# Altium schematic sheet motherboard.SchDoc
size B; SheetNumber: 1; SheetTotal: 1
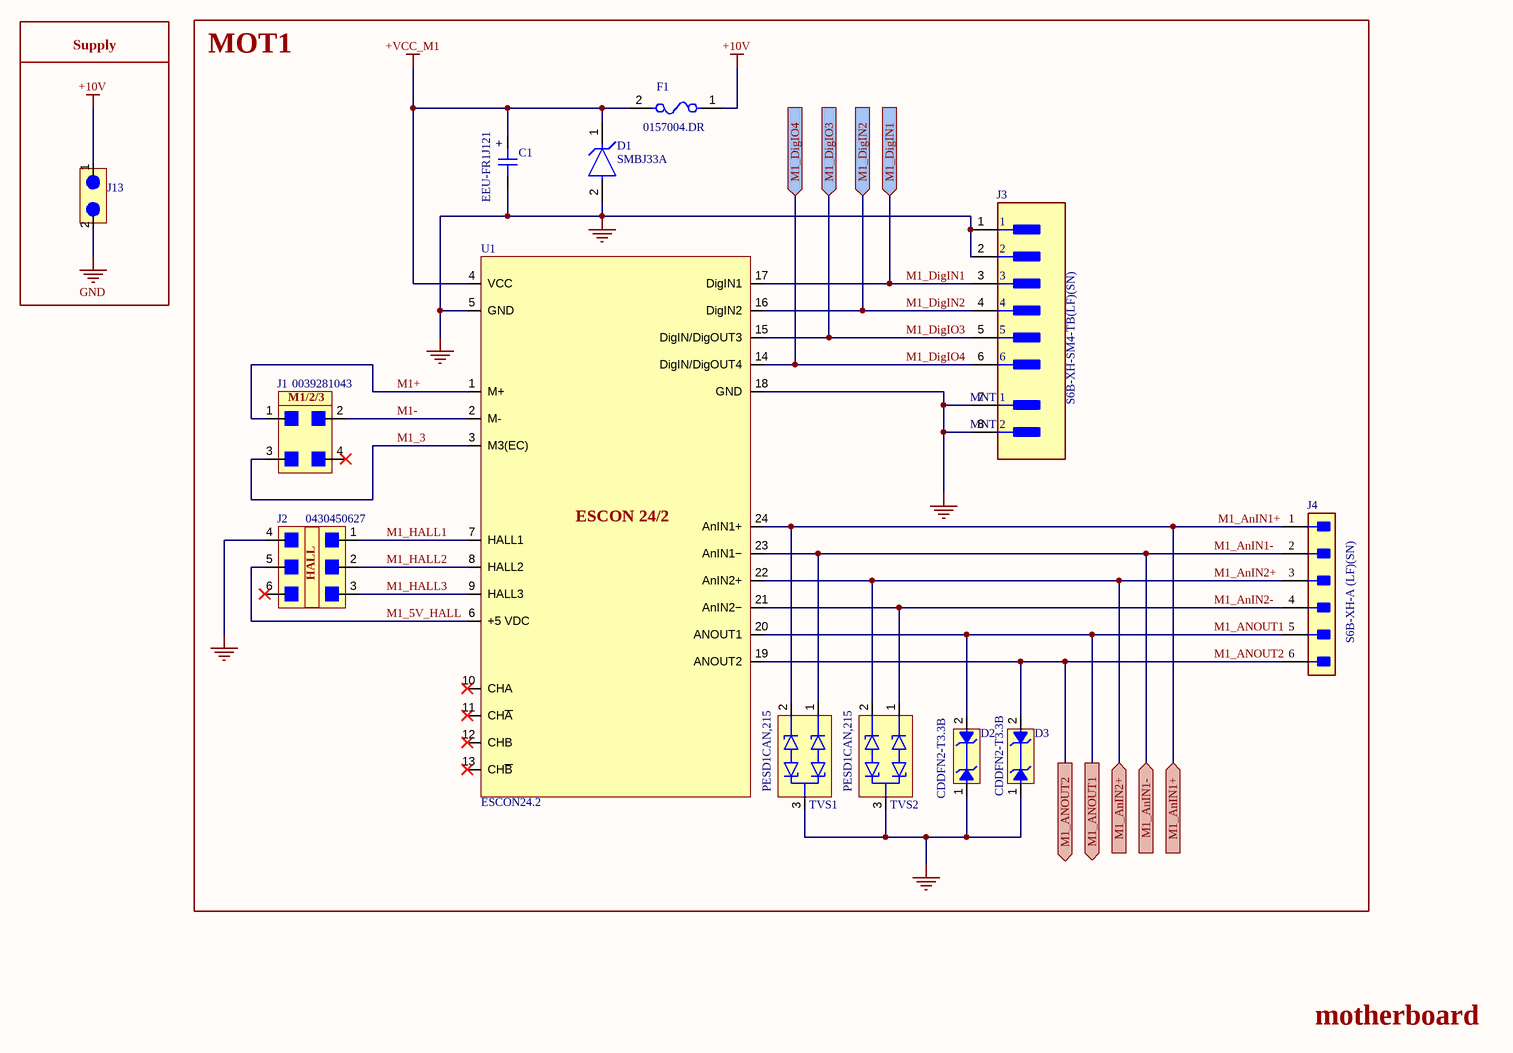
[diagram p0: motherboard.SchDoc]

## Parts
C1  EEU-FR1J121  [CAP_THT_RAD_5mm]
D1  SMBJ33A  [DO-214AA, SMB]
D2  CDDFN2-T3.3B  [D_0402]
D3  CDDFN2-T3.3B  [D_0402]
F1  0157004.DR  [NANO2]
J1  0039281043  [4.20mm Dual Row 4 Circuit CONN]
J2  0430450627  [3.00MM DUAL ROW 6 Circuit CONN]
J3  S6B-XH-SM4-TB(LF)(SN)  [S6B-XH-SM4-TB]
J4  S6B-XH-A (LF)(SN)  [JST-XH-6PIN_RA]
J13  POWER_CONN  [POWER]  (value not drawn)
TVS1  PESD1CAN,215  [SOT23]
TVS2  PESD1CAN,215  [SOT23]
U1  ESCON24.2  [ESCON24.2]

## Blocks framed on the sheet
Supply: J13
MOT1: C1 D1-D3 F1 J1-J4 TVS1 TVS2 U1

## Ports
M1_AnIN1+ (in), M1_AnIN1- (in), M1_AnIN2+ (in), M1_ANOUT1 (out), M1_ANOUT2 (out), M1_DigIN1 (in), M1_DigIN2 (in), M1_DigIO3 (in), M1_DigIO4 (in)

## Nets
+10V: F1.1 J13.1(+10V)
+VCC_M1: C1.1 D1.1(C) F1.2 U1.4(VCC)
GND: C1.2 D1.2(A) D2.1 D3.1 J2.4 J3.1 J3.2 J3.7(MNT_1) J3.8(MNT_2) J13.2(GND) TVS1.3(CC) TVS2.3(CC) U1.5(GND) U1.18(GND)
M1+: J1.1 U1.1(M+)
M1-: J1.2 U1.2(M-)
M1_3: J1.3 U1.3(M3(EC))
M1_5V_HALL: J2.5 U1.6(+5_VDC)
M1_AnIN1+: J4.1 TVS1.2(C2) U1.24(AnIN1+) ; port M1_AnIN1+
M1_AnIN1-: J4.2 TVS1.1(C1) U1.23(AnIN1−) ; port M1_AnIN1-
M1_AnIN2+: J4.3 TVS2.2(C2) U1.22(AnIN2+) ; port M1_AnIN2+
M1_AnIN2-: J4.4 TVS2.1(C1) U1.21(AnIN2−)
M1_ANOUT1: D2.2 J4.5 U1.20(ANOUT1) ; port M1_ANOUT1
M1_ANOUT2: D3.2 J4.6 U1.19(ANOUT2) ; port M1_ANOUT2
M1_DigIN1: J3.3 U1.17(DigIN1) ; port M1_DigIN1
M1_DigIN2: J3.4 U1.16(DigIN2) ; port M1_DigIN2
M1_DigIO3: J3.5 U1.15(DigIN/DigOUT3) ; port M1_DigIO3
M1_DigIO4: J3.6 U1.14(DigIN/DigOUT4) ; port M1_DigIO4
M1_HALL1: J2.1 U1.7(HALL1)
M1_HALL2: J2.2 U1.8(HALL2)
M1_HALL3: J2.3 U1.9(HALL3)

Not connected (* = marked no-connect by the designer): J1 4*; J2 6*; U1 10(CHA)* 11(CH~{A})* 12(CHB)* 13(CH~{B})*

## Notes on the sheet
- motherboard
- DWG. NO.
- REV.
- SHT.
- REVISION
- DESCRIPTION
- DATE
- APPROVED
- THIS DOCUMENT AND THE DATA DISCLOSED HEREIN OR HEREWITH IS THE PROPERTY OF ALTIUM LIMITED AND MAY BE FREELY DISTRIBUTED IN WHOLE. NO RIGHTS ARE RESERVED OR EXPRESS OR IMPLIED WARANTEE GIVEN.
- ENG:
- DSN:
- APPROVALS
- PROJECT
- DOCUMENT REVISION:
- DESIGN ITEM:
- CHK:
- BOM:
- REFERENCE DOCUMENTS
- PROJECT REVISION:
- TITLE
- FAB DWG:
- PCB DWG:
- ASSY DWG:
- SCALE:
- SIZE
- C
- CAGE CODE
- FILE NAME
- DWG NO.
- SHEET
- OF
- REV
- (in symbol 0039281043) M1/2/3
- (in symbol 0430450627) HALL
- (in symbol EEU-FR1J121) +
- (in symbol ESCON24.2) ESCON 24/2

## Library data of the parts
C1 = EEU-FR1J121: CAP, ELEC, 120 µF 63 V Aluminum Electrolytic Capacitors Radial, Can 8000 Hrs @ 105°C
D1 = SMBJ33A: TVS DIODE 33V 53.3V DO214AA; Manufacturer: Littelfuse Inc; Max Junction Temp: +150°C; Number Of Channels: 1; Breakdown Voltage: 36.7V; Peak Pulse Power: 600W; Direction: Unidirectional; Peak Pulse Current: 11.3A; Lead Free: Yes; Height: 2.61mm; Temperature Range Low: -65°C; ComponentLink2URL: https://www.littelfuse.com/~/media/electronics/datasheets/tvs_diodes/littelfuse_tvs_diode_smbj_datasheet.pdf.pdf; Manufacturer Part Number: SMBJ33A; Clamping Voltage: 53.3V; Device Class L1: Circuit Protection; Octopart: https://octopart.com/smbj33a-littelfuse-350829; Device Class L2: TVS Diodes; Digikey Description: TVS DIODE 33V 53.3V DO214AA; Automotive: No; Temperature Range High: +150°C; Package: SMBJ; ComponentLink2Description: Datasheet; Mouser Description: TVS DIODE 33V 53.3V DO214AA; Reverse Standoff Voltage: 33V; Category: Diode; Device Class L3: unset; Temperature: -65°C to +150°C; RoHS: TRUE
D2 D3 = CDDFN2-T3.3B: 8V Clamp 5A (8/20Âµs) Ipp Tvs Diode Surface Mount 2-DFN (1x0.6); MF: Bourns; Check_prices: https://www.snapeda.com/parts/CDDFN2-T3.3B/Bourns/view-part/510185/?ref=eda; Availability: Good; Price: None; SnapEDA_Link: https://www.snapeda.com/parts/CDDFN2-T3.3B/Bourns/view-part/510185/?ref=snap; Value: *; MP: CDDFN2-T3.3B; Package: XDFN-2 Bourns; Purchase-URL: https://pricing.snapeda.com/search/part/CDDFN2-T3.3B/?ref=eda
F1 = 0157004.DR: FUSE, 4 A 125 V 125 V Fuse Board Mount (Cartridge Style Excluded) Requires Holder, Surface Mount 2-SMD, Square End Block with Clip; Voltage Rating (DC): 125V; DC Cold Resistance: 16.3mR; Current Rating: 4A; Approvals: cULus; Lead Free: Lead Free; Package Quantity: 1500; Width: 0.146inch; Case/Package: SMD/SMT; Height: 0.154inch; Fuse Type: Board Mount (Cartridge Style Excluded); Max Operating Temperature: 125°C; REACH SVHC: No SVHC; Depth: 3.7mm; Housing Material: Ceramic; Fuse Current: 4A; Length: 6.5mm; Voltage Rating (AC): 125V; Packaging: Tape and Reel; Min Operating Temperature: -55°C; Mount: Surface Mount
J1 = 0039281043: Molex Connector Header Through Hole 4 position 0.165" (4.20mm)
J2 = 0430450627: Molex Connector Header Through Hole 6 position 0.118" (3.00mm)
J3 = S6B-XH-SM4-TB: CONN HEADER SMD R/A 6POS 2.5MM; Gender: Male; Number of Positions: 6; Max Current Rating: 3A; Voltage Rating: 250V; Contact Resistance: 20mR; Flammability Rating: UL94 V-0; Orientation: Right Angle; Contact Finish - Mating: TIN; Packaging: Tape and Reel; Termination: Solder; Pitch: 2.5mm; Housing Color: Beige; Insulation Material: Nylon; Fastening Type: Detent; Housing Material: Polyamide; Package Quantity: 1; Mount: Surface Mount; Insulation Color: Natural; Series: XH; Depth: 7mm; Contact Shape: Square; Color: Natural; Max Voltage Rating (AC): 250V; Min Operating Temperature: -25°C; Number of Contacts: 6; Lead Free: Lead Free; Contact Material: Copper Alloy; Contact Type: Male Pin; Length: 20mm; Max Operating Temperature: 85°C; Connector Type: Header; Number of Rows: 1; REACH SVHC: No SVHC; Contact Plating: Copper
J4 = S6B-XH-A (LF)(SN): CONN HEADER THT R/A 6POS 2.5MM; Number of Contacts: 6; Contact Resistance: 20mR; Max Current Rating: 3A; Max Voltage Rating (AC): 250V; Gender: Male; Insulation Resistance: 1GR; Wire/Cable Gauge: 22AWG; Fastening Type: Detent; Lead Pitch: 2.5mm; Flammability Rating: UL94 V-0; Contact Finish - Mating: TIN; Housing Material: Polyamide; Length: 17.4mm; Termination: Solder; Contact Type: Male Pin; Number of Positions: 6; Mount: Through Hole; Orientation: Right Angle; Voltage Rating (AC): 250V; Contact Shape: Square; Lead Free: Lead Free; Insulation Material: Nylon; Insulation Color: Natural; Contact Plating: Tin; Connector Type: Header; Housing Color: White; Color: Natural; Package Quantity: 500; Contact Material: Brass; Packaging: Bulk; Pitch: 2.5mm; Series: XH; Number of Rows: 1; Min Operating Temperature: -25°C; Voltage Rating: 250V; REACH SVHC: No SVHC; Current Rating: 3A; Depth: 11.5mm; Max Operating Temperature: 85°C
J13 = Power_CONN_NO_BOM
TVS1 TVS2 = PESD1CAN,215: 70V Clamp 3A (8/20Âµs) Ipp Tvs Diode Surface Mount TO-236AB; MF: Nexperia USA Inc.; SnapEDA_Link: https://www.snapeda.com/parts/PESD1CAN,215/Nexperia/view-part/?ref=snap; Package: SC-59 Nexperia USA; Value: *; MP: PESD1CAN,215; Check_prices: https://www.snapeda.com/parts/PESD1CAN,215/Nexperia/view-part/?ref=eda
U1 = ESCON24.2: ESCON24.2 Motor Controller Module